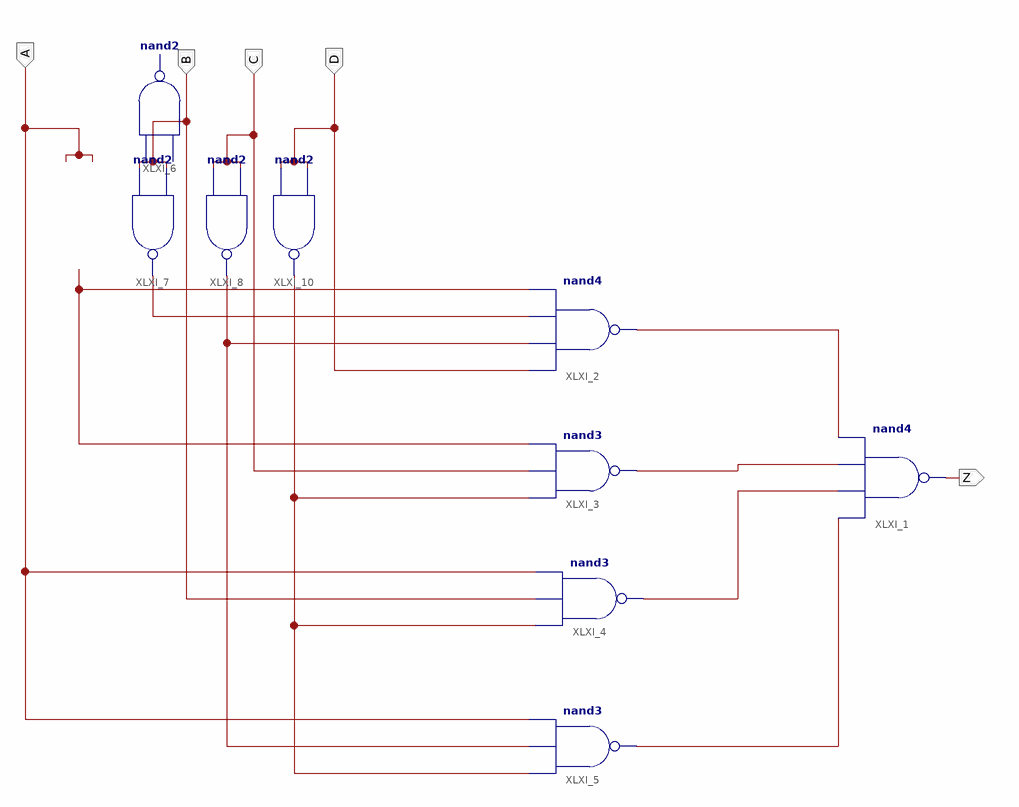
[diagram p0: schematic sheet 1]
// Xilinx ISE schematic p1ej1.sch (spartan3) as structural Verilog: 9 symbols, 5 ports
module p1ej1 (
  input  D,
  input  C,
  input  B,
  input  A,
  output Z
);

  wire XLXN_1, XLXN_2, XLXN_3, XLXN_6, XLXN_23, XLXN_24, XLXN_25, XLXN_26;

  nand XLXI_1 (Z, XLXN_26, XLXN_25, XLXN_24, XLXN_23);
  nand XLXI_2 (XLXN_23, D, XLXN_3, XLXN_2, XLXN_1);
  nand XLXI_3 (XLXN_24, XLXN_6, C, XLXN_1);
  nand XLXI_4 (XLXN_25, XLXN_6, B, A);
  nand XLXI_5 (XLXN_26, XLXN_6, XLXN_3, A);
  nand XLXI_6 (XLXN_1, A, A);
  nand XLXI_7 (XLXN_2, B, B);
  nand XLXI_8 (XLXN_3, C, C);
  nand XLXI_10 (XLXN_6, D, D);
endmodule
